# Altium schematic sheet 05-Connector.SchDoc: 手持设备通讯板
size A4; Address1: 张三; Address2: 441521200506202339; Address3: 15812345678; SheetNumber: 7; SheetTotal: 7
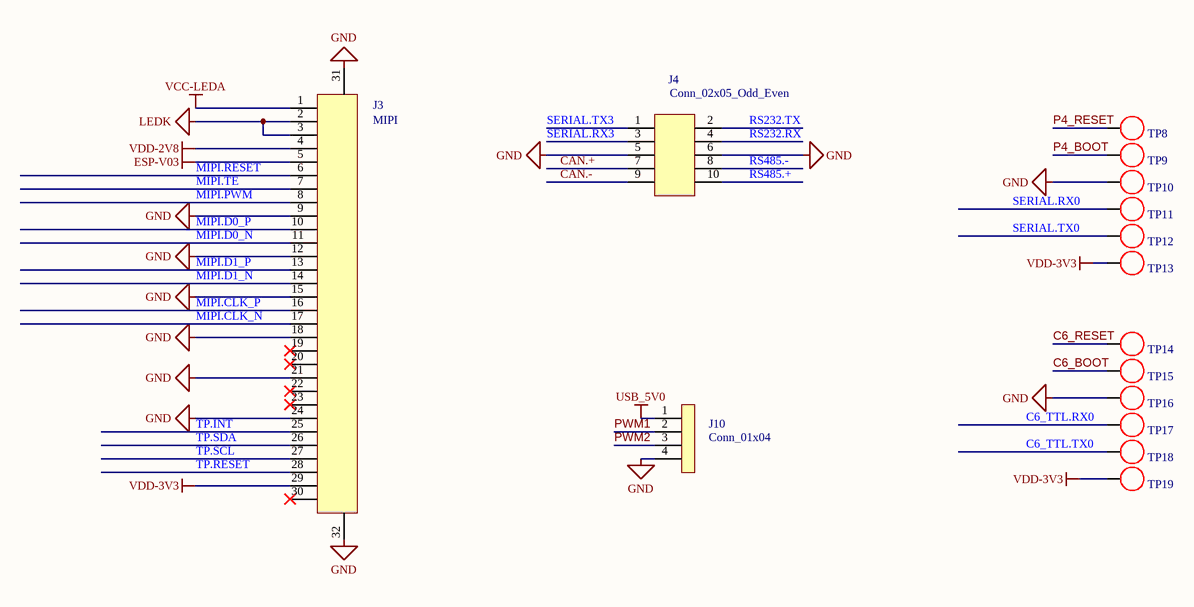
[diagram p0: 05-Connector.SchDoc]

## Parts
J3  MIPI  [FPC-SMD_30P-P0.50_XUNPU_FPC-05F-30PH20]
J4  Conn_02x05_Odd_Even  [HDR-TH_10P-P2.54-H-M-R2-C5-S2.54-N]
J10  Conn_01x04  [HDR-TH_4P-P2.54-H-M-W10.4]
TP8  TP8  [Test-Point-1*1mm]  (value not drawn)
TP9  TP9  [Test-Point-1*1mm]  (value not drawn)
TP10  TP10  [Test-Point-1*1mm]  (value not drawn)
TP11  TP11  [Test-Point-1*1mm]  (value not drawn)
TP12  TP12  [Test-Point-1*1mm]  (value not drawn)
TP13  TP13  [Test-Point-1*1mm]  (value not drawn)
TP14  TP14  [Test-Point-1*1mm]  (value not drawn)
TP15  TP15  [Test-Point-1*1mm]  (value not drawn)
TP16  TP16  [Test-Point-1*1mm]  (value not drawn)
TP17  TP17  [Test-Point-1*1mm]  (value not drawn)
TP18  TP18  [Test-Point-1*1mm]  (value not drawn)
TP19  TP19  [Test-Point-1*1mm]  (value not drawn)

## Nets
ESP-V03: J3.5
GND: J3.9 J3.12 J3.15 J3.18 J3.21 J3.24 J3.31 J3.32 J4.5 J4.6 J10.4 TP10.1 TP16.1
LEDK: J3.2 J3.3
USB_5V0: J10.1
VCC-LEDA: J3.1
VDD-2V8: J3.4
VDD-3V3: J3.29 TP13.1 TP19.1
C6_BOOT: TP15.1
C6_RESET: TP14.1
C6_TTL.RX0: TP17.1
C6_TTL.TX0: TP18.1
CAN.+: J4.7
CAN.-: J4.9
MIPI.CLK_N: J3.17
MIPI.CLK_P: J3.16
MIPI.D0_N: J3.11
MIPI.D0_P: J3.10
MIPI.D1_N: J3.14
MIPI.D1_P: J3.13
MIPI.PWM: J3.8
MIPI.RESET: J3.6
MIPI.TE: J3.7
P4_BOOT: TP9.1
P4_RESET: TP8.1
PWM1: J10.2
PWM2: J10.3
RS232.RX: J4.4
RS232.TX: J4.2
RS485.+: J4.10
RS485.-: J4.8
SERIAL.RX0: TP11.1
SERIAL.RX3: J4.3
SERIAL.TX0: TP12.1
SERIAL.TX3: J4.1
TP.INT: J3.25
TP.RESET: J3.28
TP.SCL: J3.27
TP.SDA: J3.26

Not connected (* = marked no-connect by the designer): J3 19* 20* 22* 23* 30*

## Notes on the sheet
- 选手信息
- 图页名称
- 当前日期
- 当前时间
- 项目名称
- 第          幅
- 共          幅

## Library data of the parts
TP8-TP19 = TP?